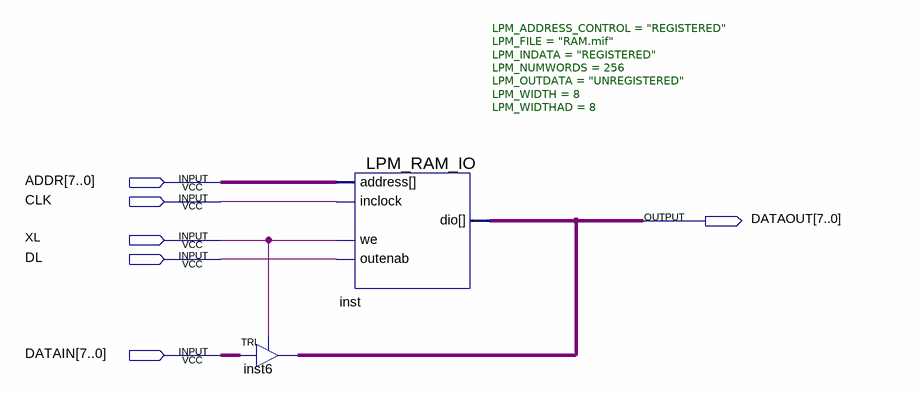
[diagram p0: schematic sheet]
// Quartus schematic RAM.bdf as structural Verilog: 2 symbols, 6 pins
module RAM (
  input  [7:0] ADDR,
  input  CLK,
  input  XL,
  input  DL,
  input  [7:0] DATAIN,
  output [7:0] DATAOUT
);

  TRI inst6[7:0] (.IN(DATAIN), .OE(XL), .OUT(DATAOUT));
  LPM_RAM_IO #(.LPM_ADDRESS_CONTROL("REGISTERED"), .LPM_FILE("RAM.mif"), .LPM_INDATA("REGISTERED"), .LPM_NUMWORDS(256), .LPM_OUTDATA("UNREGISTERED"), .LPM_WIDTH(8), .LPM_WIDTHAD(8)) inst (
    .address(ADDR), .inclock(CLK), .we(XL), .outenab(DL), .dio(DATAOUT));
endmodule
